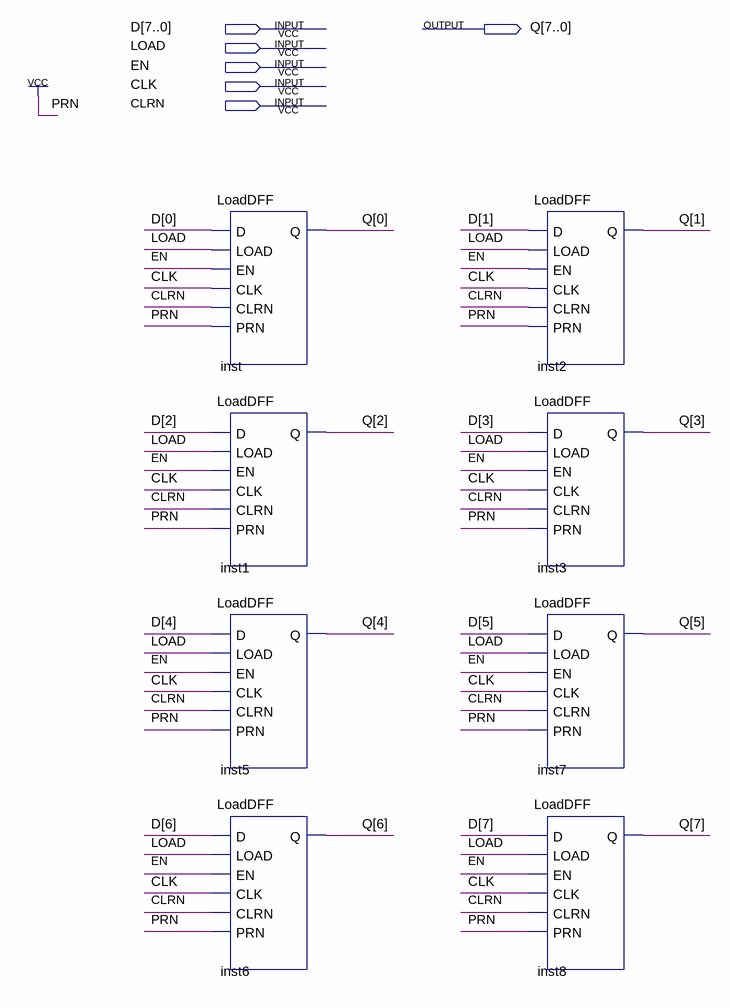
[diagram p0: schematic sheet]
// Quartus schematic 8BitRegister.bdf as structural Verilog: 8 symbols, 6 pins
module \8BitRegister  (
  input  [7:0] D,
  input  LOAD,
  input  EN,
  input  CLK,
  input  CLRN,
  output [7:0] Q
);

  LoadDFF inst (.D(D[0]), .LOAD(LOAD), .EN(EN), .CLK(CLK), .CLRN(CLRN), .PRN(1'b1), .Q(Q[0]));
  LoadDFF inst1 (.D(D[2]), .LOAD(LOAD), .EN(EN), .CLK(CLK), .CLRN(CLRN), .PRN(1'b1), .Q(Q[2]));
  LoadDFF inst5 (.D(D[4]), .LOAD(LOAD), .EN(EN), .CLK(CLK), .CLRN(CLRN), .PRN(1'b1), .Q(Q[4]));
  LoadDFF inst6 (.D(D[6]), .LOAD(LOAD), .EN(EN), .CLK(CLK), .CLRN(CLRN), .PRN(1'b1), .Q(Q[6]));
  LoadDFF inst2 (.D(D[1]), .LOAD(LOAD), .EN(EN), .CLK(CLK), .CLRN(CLRN), .PRN(1'b1), .Q(Q[1]));
  LoadDFF inst3 (.D(D[3]), .LOAD(LOAD), .EN(EN), .CLK(CLK), .CLRN(CLRN), .PRN(1'b1), .Q(Q[3]));
  LoadDFF inst7 (.D(D[5]), .LOAD(LOAD), .EN(EN), .CLK(CLK), .CLRN(CLRN), .PRN(1'b1), .Q(Q[5]));
  LoadDFF inst8 (.D(D[7]), .LOAD(LOAD), .EN(EN), .CLK(CLK), .CLRN(CLRN), .PRN(1'b1), .Q(Q[7]));
endmodule
